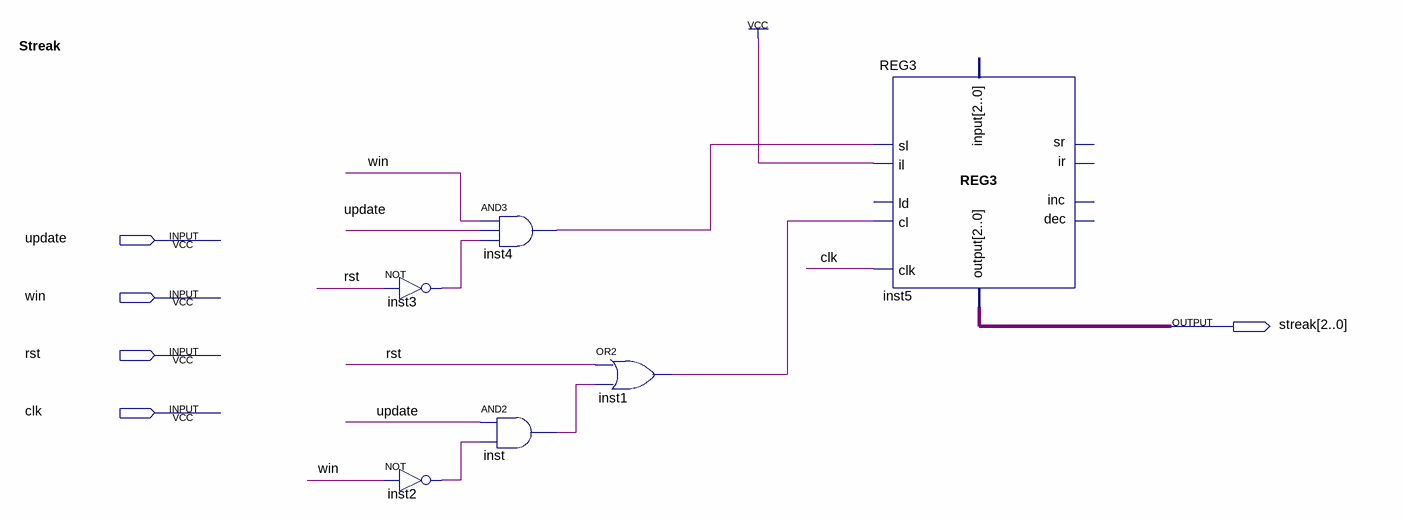
[diagram p0: schematic sheet]
// Quartus schematic Streak.bdf as structural Verilog: 6 symbols, 5 pins
module Streak (
  input  update,
  input  win,
  input  rst,
  input  clk,
  output [2:0] streak
);

  wire inst1_out, inst2_out, inst3_out, inst4_out, inst_out;

  not inst3 (inst3_out, rst);
  not inst2 (inst2_out, win);
  and inst4 (inst4_out, win, update, inst3_out);
  and inst (inst_out, update, inst2_out);
  or inst1 (inst1_out, rst, inst_out);
  REG3 inst5 (
    .clk(clk), .sl(inst4_out), .il(1'b1), .cl(inst1_out), .\output (streak));  // open: ld, input, sr, ir, inc, dec

  // Notes on the sheet:
  //   Streak
endmodule
